# EAGLE schematic display (EAGLE 6.5.0)
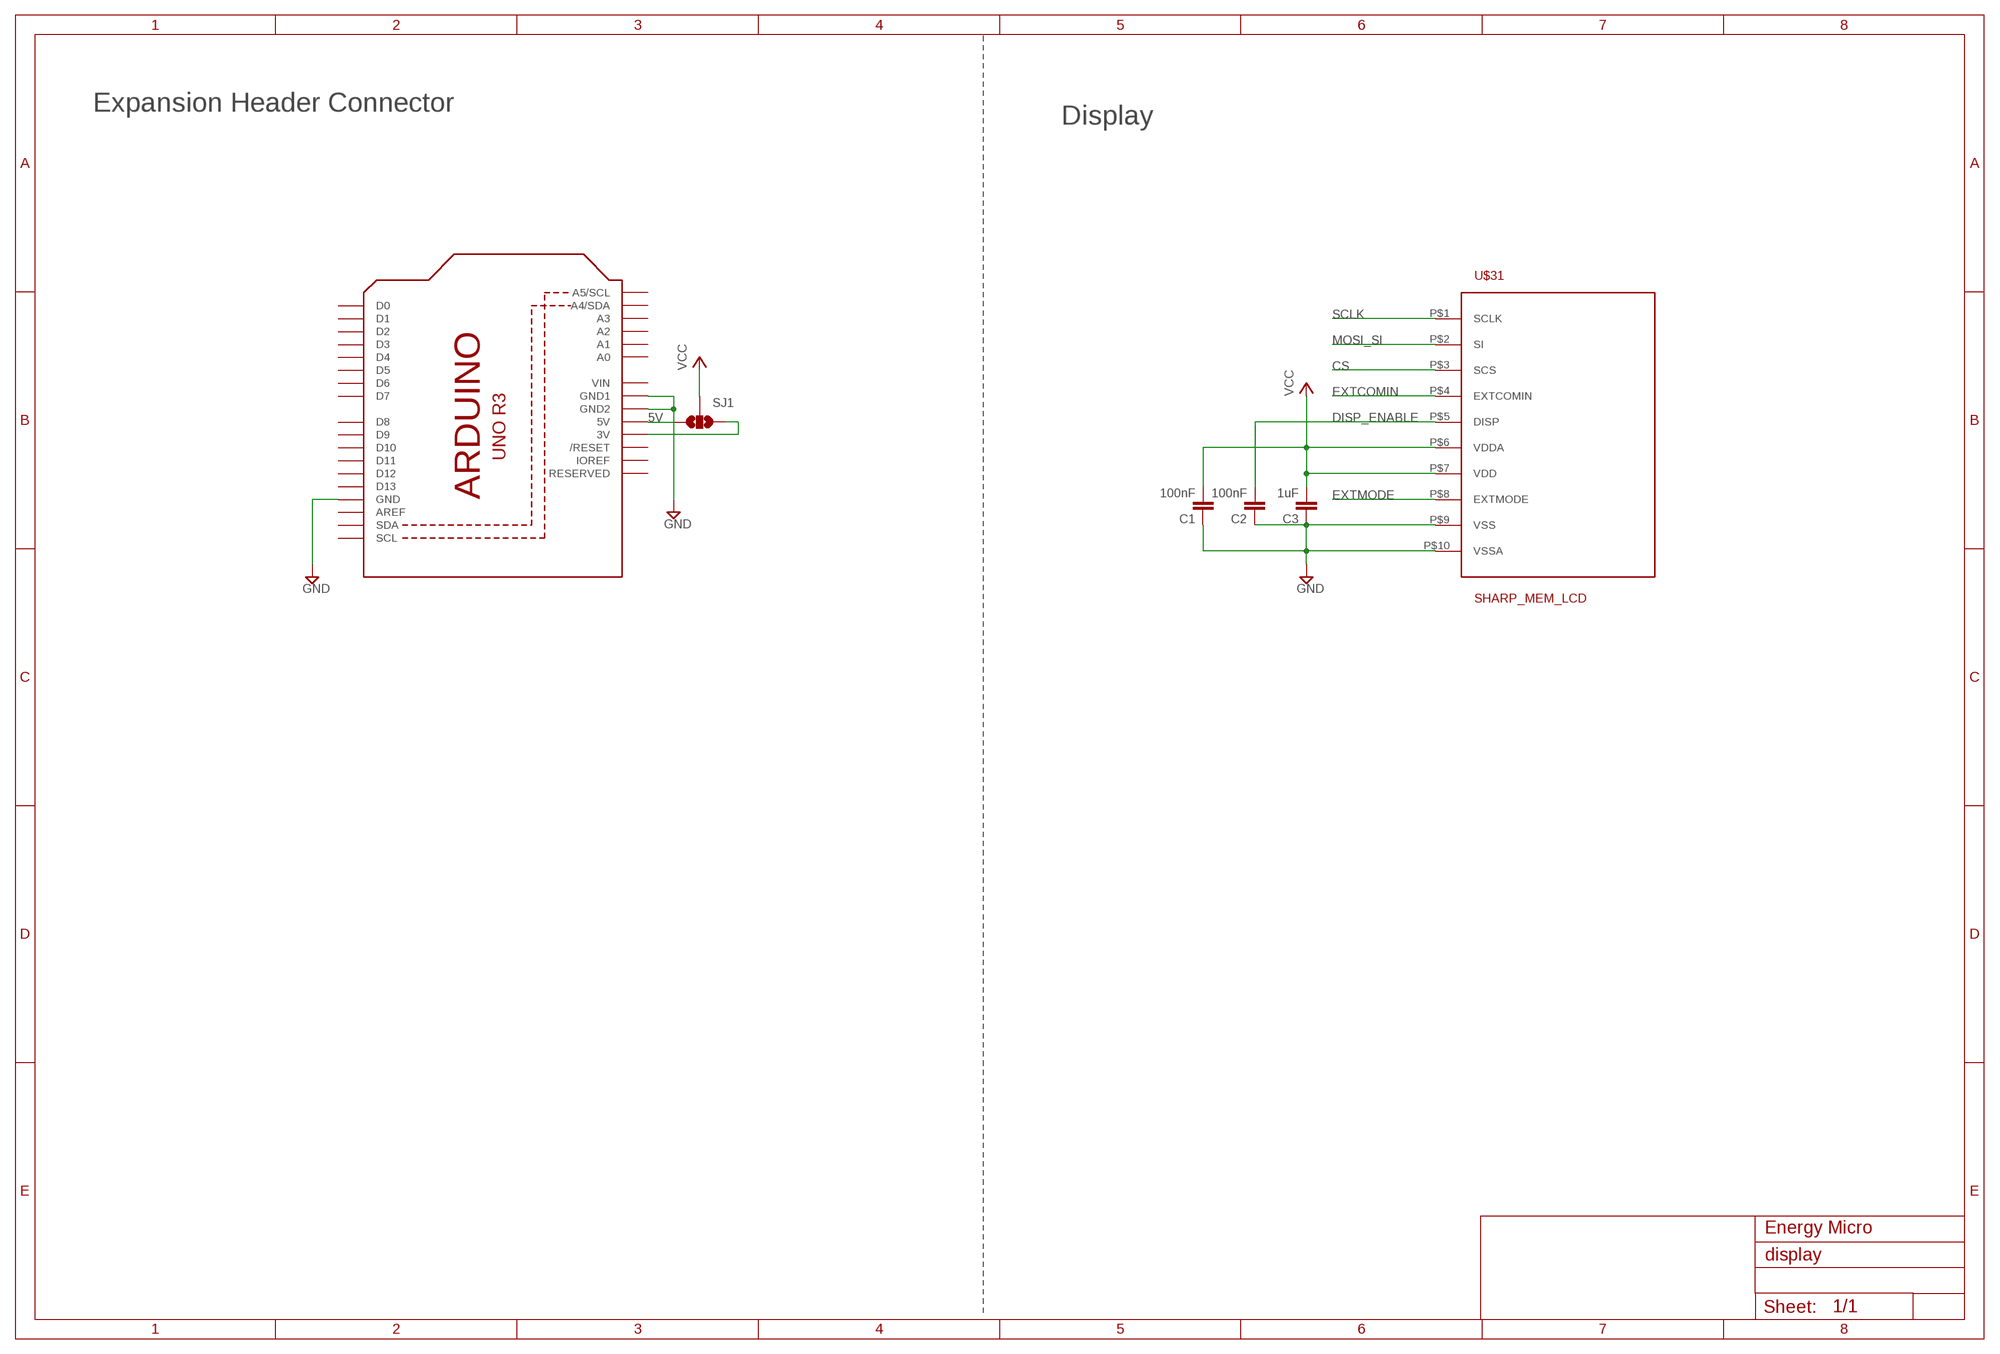
[diagram p0: schematic, sheet 1]

## Parts
C1  100nF  C-EUC0402K  [C0402K]
C2  100nF  C-EUC0402K  [C0402K]
C3  1uF  C-EUC0402K  [C0402K]
SJ1  SOLDERJUMPER_2WAYT  [SJ_2]
U1  ARDUINOR3-MINI  [ARDUINOR3-MINI]
U$31  SHARP_MEM_LCD  [SHARP_MEM_LCD]

## Nets
5V: SJ1.3 U1.5V
CS: U$31.P$3(SCS)
DISP_ENABLE: C2.2 U$31.P$5(DISP)
EXTCOMIN: U$31.P$4(EXTCOMIN)
EXTMODE: U$31.P$8(EXTMODE)
GND: C1.1 C2.1 C3.1 U1.GND U1.GND1 U1.GND2 U$31.P$9(VSS) U$31.P$10(VSSA)
MOSI_SI: U$31.P$2(SI)
SCLK: U$31.P$1(SCLK)
VCC: C1.2 C3.2 SJ1.2 U$31.P$6(VDDA) U$31.P$7(VDD)
VMCU_3V3: SJ1.1 U1.3V
Unconnected: U1.A0 U1.A1 U1.A2 U1.A3 U1.A4(A4/SDA) U1.A5(A5/SCL) U1.AREF U1.D0 U1.D1 U1.D2 U1.D3 U1.D4 U1.D5 U1.D6 U1.D7 U1.D8 U1.D9 U1.D10 U1.D11 U1.D12 U1.D13 U1.IOREF U1.RESERVED U1.RESET(/RESET) U1.SCL U1.SDA

## Notes on the sheet
- Expansion Header Connector
- Display
- Energy Micro

## Power pins joined to a net without a drawn wire
VIN: U1.VIN

## Library data of the parts
C1-C3 = rcl:C-EU: CAPACITOR, European symbol
SJ1 = SparkFun_mod:SOLDERJUMPER_2WAY: Solder Jumper 2 way solder jumper
U1 = adafruit:ARDUINOR3: This is a new object for the new Arduino R3 - with extra pins that you may want to use (such as IOref, and duplicated A4/A5
U$31 = sharp_mem_lcd:SHARP_MEM_LCD